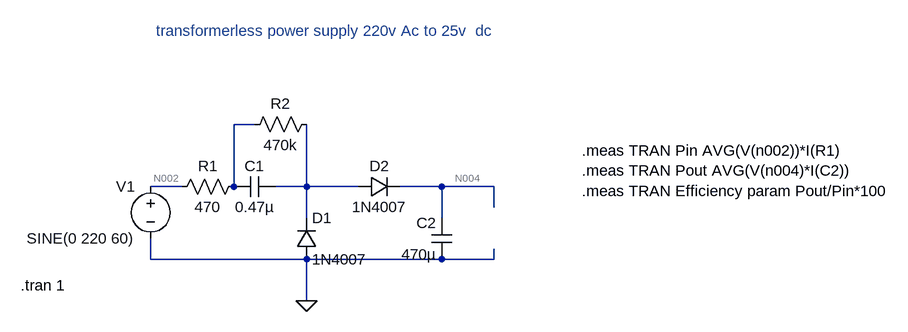
[diagram p0: schematic Transformerless Power Supply – 220V AC to 25V DC.asc]
Transformerless Power Supply – 220V AC to 25V DC.asc, the LTspice schematic file:
Version 4
SHEET 1 1340 680
WIRE 128 80 96 80
WIRE 16 176 -32 176
WIRE 96 176 96 80
WIRE 208 176 208 80
WIRE 208 176 160 176
WIRE 288 176 208 176
WIRE 416 176 352 176
WIRE 496 176 416 176
WIRE 496 208 496 176
WIRE 208 224 208 176
WIRE 416 224 416 176
WIRE -32 288 -32 256
WIRE 208 288 208 272
WIRE 208 288 -32 288
WIRE 416 288 208 288
WIRE 496 288 496 272
WIRE 496 288 416 288
WIRE 208 352 208 288
FLAG 208 352 0
SYMBOL diode 192 288 M180
WINDOW 0 24 64 Left 2
WINDOW 3 24 0 Left 2
SYMATTR InstName D1
SYMATTR Value 1N4007
SYMBOL diode 288 192 R270
WINDOW 0 32 32 VTop 2
WINDOW 3 0 32 VBottom 2
SYMATTR InstName D2
SYMATTR Value 1N4007
SYMBOL cap 160 160 R90
WINDOW 0 0 32 VBottom 2
WINDOW 3 32 32 VTop 2
SYMATTR InstName C1
SYMATTR Value 0.47µ
SYMBOL cap 432 288 R180
WINDOW 0 24 56 Left 2
WINDOW 3 24 8 Left 2
SYMATTR InstName C2
SYMATTR Value 470µ
SYMBOL res 112 160 R90
WINDOW 0 0 56 VBottom 2
WINDOW 3 32 56 VTop 2
SYMATTR InstName R1
SYMATTR Value 470
SYMBOL res 224 64 R90
WINDOW 0 0 56 VBottom 2
WINDOW 3 32 56 VTop 2
SYMATTR InstName R2
SYMATTR Value 470k
SYMBOL voltage -32 160 M0
WINDOW 123 0 0 Left 0
WINDOW 39 0 0 Left 0
SYMATTR InstName V1
SYMATTR Value SINE(0 220 60)
TEXT -232 328 Left 2 !.tran 1
TEXT -24 -64 Left 2 ;transformerless power supply 220v Ac to 25v  dc
TEXT 632 120 Left 2 !.meas TRAN Pin AVG(V(n002))*I(R1)\n.meas TRAN Pout AVG(V(n004)*I(C2))\n.meas TRAN Efficiency param Pout/Pin*100

The netlist it stands for:
* Transformerless Power Supply – 220V AC to 25V DC.asc
D1 0 N003 1N4007
D2 N003 N004 1N4007
C1 N003 N001 0.47µ
C2 0 N004 470µ
R1 N001 N002 470
R2 N003 N001 470k
V1 N002 0 SINE(0 220 60)
.model D D
.lib standard.dio
.tran 1
* transformerless power supply 220v Ac to 25v  dc
.meas TRAN Pin AVG(V(n002))*I(R1)
.meas TRAN Pout AVG(V(n004)*I(C2))
.meas TRAN Efficiency param Pout/Pin*100
.backanno
.end